# Altium schematic sheet Topcheat.SchDoc
size A3; SheetNumber: 1; SheetTotal: 3
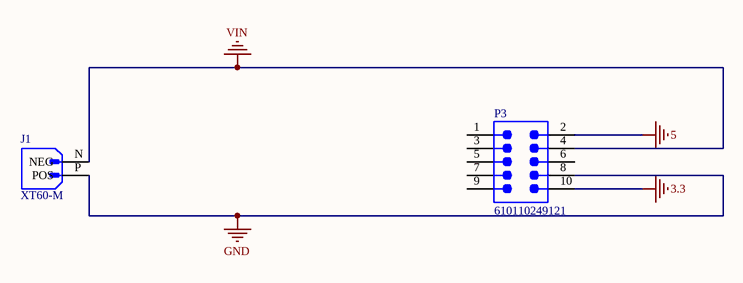
[diagram p0: Topcheat.SchDoc]

## Parts
J1  XT60-M  [AMASS_XT60-M]
P3  610110249121  [610110249121]

## Nets
3.3: P3.10
5: P3.2
GND: J1.P(POS) P3.8
VIN: J1.N(NEG) P3.4

Not connected (* = marked no-connect by the designer): P3 1 3 5 6 7 9

## Library data of the parts
J1 = CMP-047-000000-1: Plug; DC supply; XT60; male; PIN: 2; for cable; soldered; 30A; 500V; MF: AMASS; SnapEDA_Link: https://www.snapeda.com/parts/XT60-M/AMASS/view-part/?ref=snap; Design Item ID: XT60-M; Pin Count: 2; Check_prices: https://www.snapeda.com/parts/XT60-M/AMASS/view-part/?ref=eda; Component Type: Standard; Package: Package; MP: XT60-M; Source: XT60-M.SchLib; Value: *
P3 = CMP-002-00609-1: Board Connector, 10 Contact(s), 2 Row(s), Male, Right Angle, Surface Mount Terminal; Connector Type: Male Pin; Min Operating Temperature: -40°C; Gender: Male; Pins: 10; Max Operating Temperature: 105°C; Mounting Technology: Surface Mount